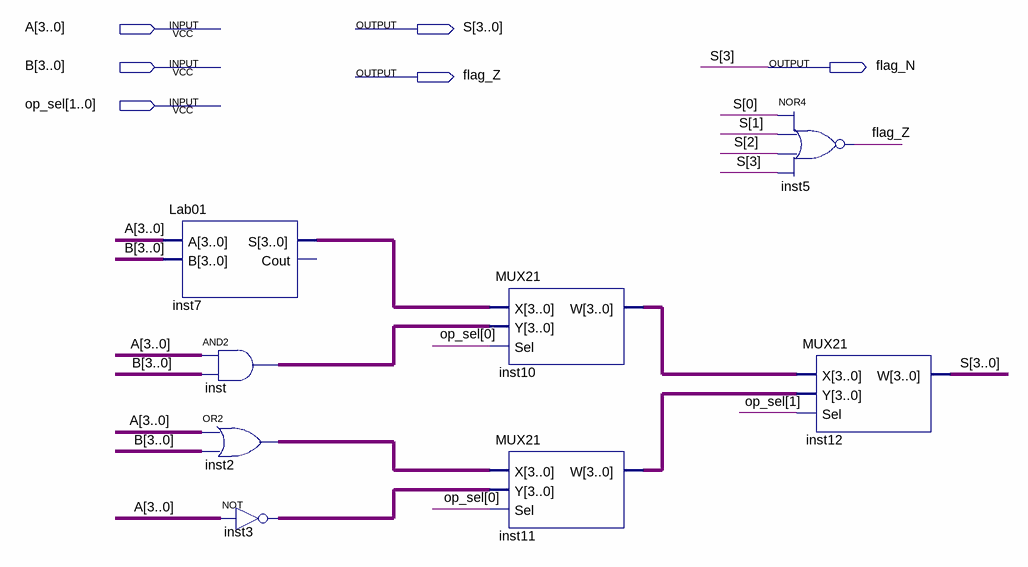
[diagram p0: schematic sheet]
// Quartus schematic ULA.bdf as structural Verilog: 8 symbols, 6 pins
module ULA (
  input  [3:0] A,
  input  [3:0] B,
  input  [1:0] op_sel,
  output [3:0] S,
  output flag_N,
  output flag_Z
);

  wire [3:0] inst2_out, inst3_out, inst7_s, inst10_w, inst11_w, inst_out;

  Lab01 inst7 (.A(A), .B(B), .S(inst7_s));  // open: Cout
  assign inst_out = A & B;  // AND2 inst, 4 bits wide
  assign inst2_out = A | B;  // OR2 inst2, 4 bits wide
  assign inst3_out = ~A;  // NOT inst3, 4 bits wide
  MUX21 inst10 (.X(inst7_s), .Y(inst_out), .Sel(op_sel[0]), .W(inst10_w));
  MUX21 inst11 (.X(inst2_out), .Y(inst3_out), .Sel(op_sel[0]), .W(inst11_w));
  nor inst5 (flag_Z, S[0], S[1], S[2], flag_N);
  MUX21 inst12 (.X(inst10_w), .Y(inst11_w), .Sel(op_sel[1]), .W({flag_N, S[2:0]}));

  assign S[3] = flag_N;
endmodule
